# Altium schematic sheet CYUSB.SchDoc
size A3
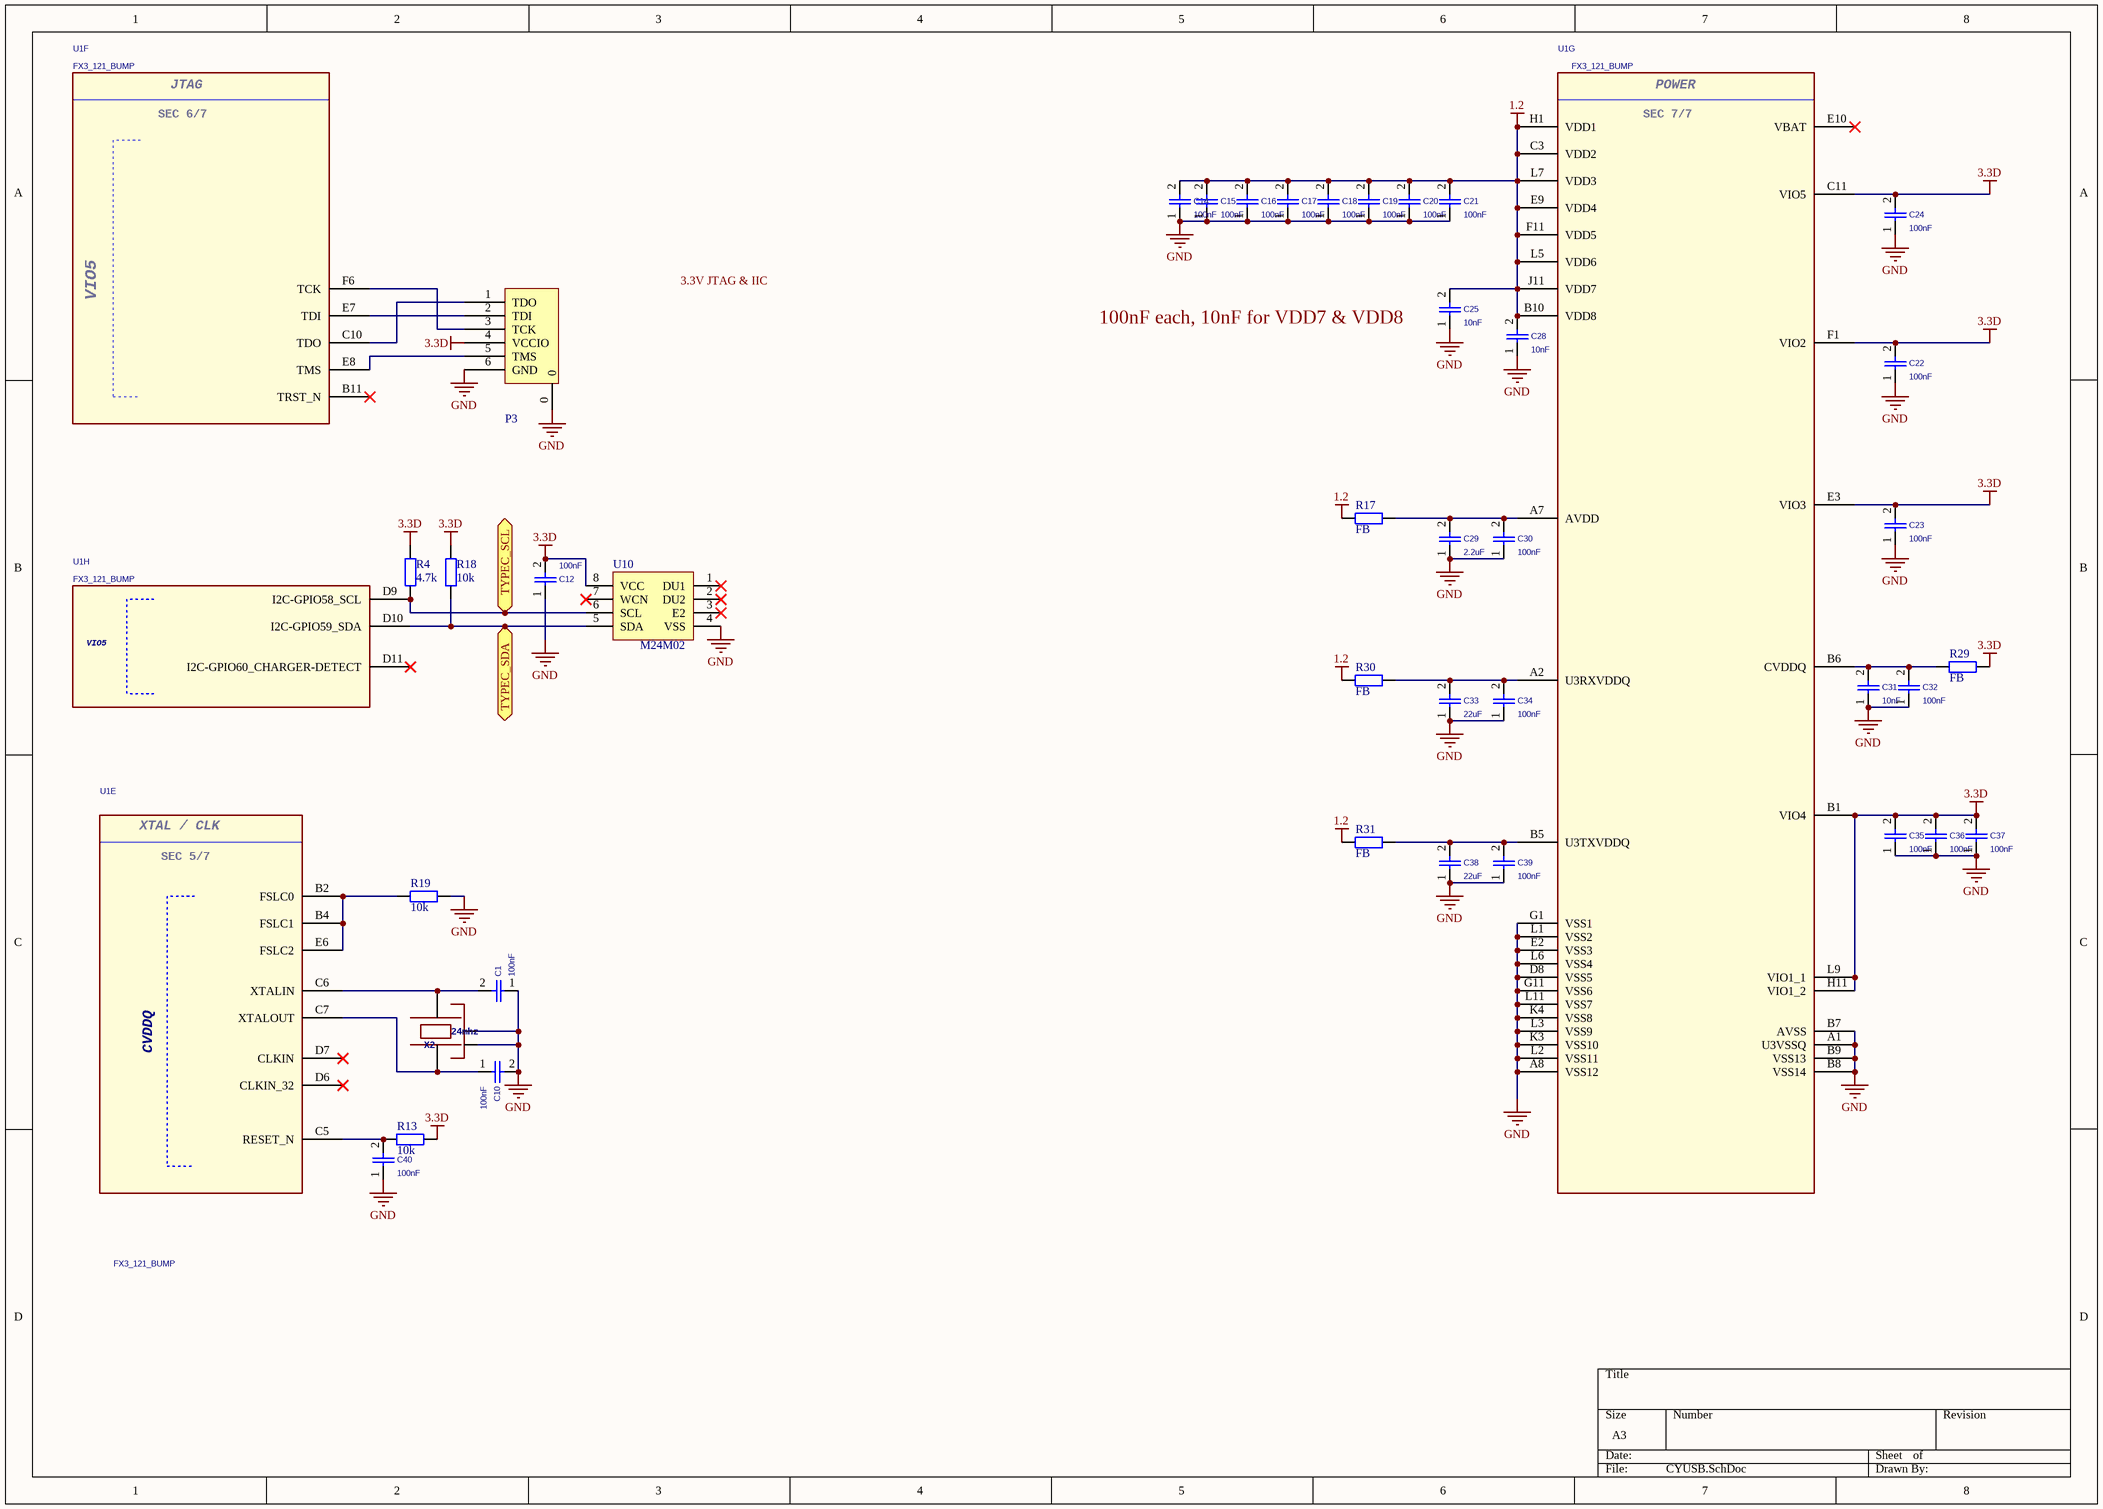
[diagram p0: CYUSB.SchDoc]

## Parts
C1  100nF  [0201]
C10  100nF  [0201]
C12  100nF  [0201]
C14  100nF  [0201]
C15  100nF  [0201]
C16  100nF  [0201]
C17  100nF  [0201]
C18  100nF  [0201]
C19  100nF  [0201]
C20  100nF  [0201]
C21  100nF  [0201]
C22  100nF  [0201]
C23  100nF  [0201]
C24  100nF  [0201]
C25  10nF  [0201]
C28  10nF  [0201]
C29  2.2uF  [0201]
C30  100nF  [0201]
C31  10nF  [0201]
C32  100nF  [0201]
C33  22uF  [0603L]
C34  100nF  [0201]
C35  100nF  [0201]
C36  100nF  [0201]
C37  100nF  [0201]
C38  22uF  [0603L]
C39  100nF  [0201]
C40  100nF  [0201]
P3  JTAG-6P  [GH1.25-6]  (value not drawn)
R4  4.7k  [0201]
R13  10k  [0201]
R17  FB  [0402]
R18  10k  [0201]
R19  10k  [0201]
R29  FB  [0402]
R30  FB  [0402]
R31  FB  [0402]
U1  FX3_121_BUMP  [FX3_121_BUMP]  (parts E,F,G,H of 8)
U10  M24M02  [SO8]
X2  24mhz  [OSCILLATOR-2.5x2.0]

## Ports
TYPEC_SCL, TYPEC_SDA

## Nets
1.2: C14.2 C15.2 C16.2 C17.2 C18.2 C19.2 C20.2 C21.2 C25.2 C28.2 R17.2 R30.2 R31.2 U1.B10(VDD8) U1.C3(VDD2) U1.E9(VDD4) U1.F11(VDD5) U1.H1(VDD1) U1.J11(VDD7) U1.L5(VDD6) U1.L7(VDD3)
3.3D: C12.2 C22.2 C23.2 C24.2 C35.2 C36.2 C37.2 P3.4(VCCIO) R4.2 R13.2 R18.2 R29.1 U1.B1(VIO4) U1.C11(VIO5) U1.E3(VIO3) U1.F1(VIO2) U1.H11(VIO1_2) U1.L9(VIO1_1) U10.8(VCC)
GND: C1.1 C10.2 C12.1 C14.1 C15.1 C16.1 C17.1 C18.1 C19.1 C20.1 C21.1 C22.1 C23.1 C24.1 C25.1 C28.1 C29.1 C30.1 C31.1 C32.1 C33.1 C34.1 C35.1 C36.1 C37.1 C38.1 C39.1 C40.1 P3.0 P3.6(GND) R19.2 U1.A1(U3VSSQ) U1.A8(VSS12) U1.B7(AVSS) U1.B8(VSS14) U1.B9(VSS13) U1.D8(VSS5) U1.E2(VSS3) U1.G1(VSS1) U1.G11(VSS6) U1.K3(VSS10) U1.K4(VSS8) U1.L1(VSS2) U1.L2(VSS11) U1.L3(VSS9) U1.L6(VSS4) U1.L11(VSS7) U10.4(VSS) X2.2(NC_2) X2.4(NC_4)
TYPEC_SCL: R4.1 U1.D9(I2C-GPIO58_SCL) U10.6(SCL) ; port TYPEC_SCL
TYPEC_SDA: R18.1 U1.D10(I2C-GPIO59_SDA) U10.5(SDA) ; port TYPEC_SDA
NetC1_2: C1.2 U1.C6(XTALIN) X2.3
NetC10_1: C10.1 U1.C7(XTALOUT) X2.1
NetC29_2: C29.2 C30.2 R17.1 U1.A7(AVDD)
NetC31_2: C31.2 C32.2 R29.2 U1.B6(CVDDQ)
NetC33_2: C33.2 C34.2 R30.1 U1.A2(U3RXVDDQ)
NetC38_2: C38.2 C39.2 R31.1 U1.B5(U3TXVDDQ)
NetC40_2: C40.2 R13.1 U1.C5(RESET_N)
NetP3_1: P3.1(TDO) U1.C10(TDO)
NetP3_2: P3.2(TDI) U1.E7(TDI)
NetP3_3: P3.3(TCK) U1.F6(TCK)
NetP3_5: P3.5(TMS) U1.E8(TMS)
NetR19_1: R19.1 U1.B2(FSLC0) U1.B4(FSLC1) U1.E6(FSLC2)

Not connected (* = marked no-connect by the designer): U1 B11(TRST_N)* D6(CLKIN_32)* D7(CLKIN)* D11(I2C-GPIO60_CHARGER-DETECT)* E10(VBAT)*; U10 1(DU1)* 2(DU2)* 3(E2)* 7(WCN)*

## Notes on the sheet
- (near C25) 100nF each, 10nF for VDD7 & VDD8
- Labels drawn without touching a wire or pin: 3.3V JTAG & IIC
- (in symbol FX3_121_BUMP_10, part E) XTAL / CLK; SEC 5/7
- (in symbol FX3_121_BUMP_10, part F) JTAG; SEC 6/7
- (in symbol FX3_121_BUMP_10, part G) POWER; SEC 7/7

## Library data of the parts
C1 C10 C12 C14-C25 C28-C40 = CAP/0402: 1st Part Field: 0402
R4 R13 R17-R19 R29-R31 = Res2: Resistor; Published: 8-Jun-2000; LatestRevisionDate: 17-Jul-2002; LatestRevisionNote: Re-released for DXP Platform.; PackageReference: AXIAL-0.4; Publisher: Altium Limited; PackageDescription: Axial Device, Thru-Hole; 2 Leads; 0.4 in Pin Spacing
U1 = FX3_121_BUMP_10: FX3; Manufacturer: Cypress
X2 = OSCILLATOR-3.2X2.5: Crystal Oscillator in 3.2x2.5 SMD